# Altium project Flashlight PCB.PrjPCB
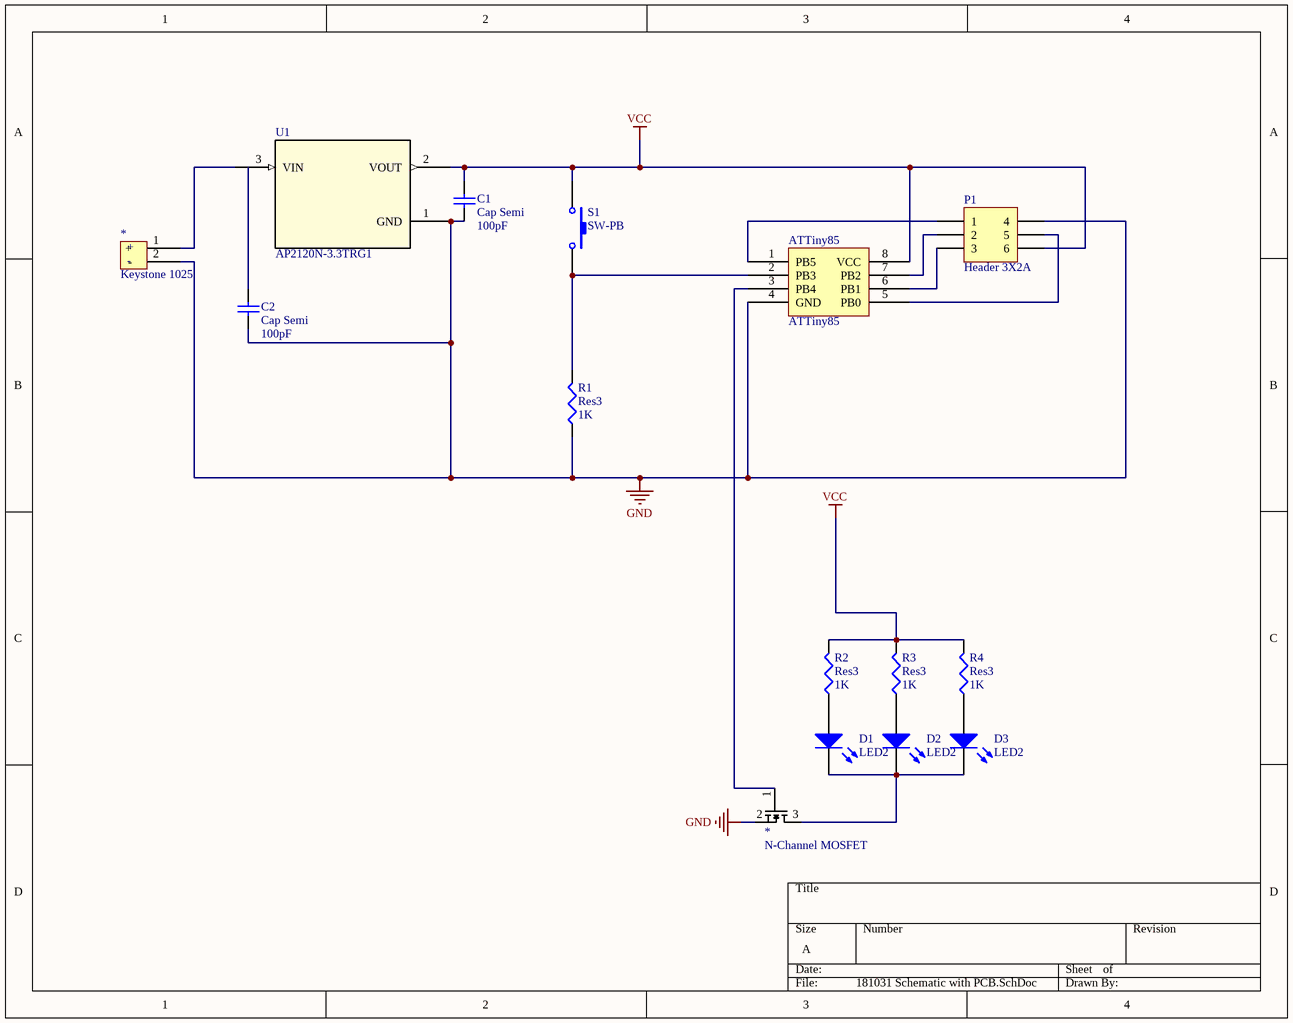
[diagram p0: 181031 Schematic with PCB.SchDoc]
1 sheet, 15 parts. Net scope: global (net labels, ports and power ports of the same name join across sheets).
Board file: Final Flashlight PCB.PcbDoc

## Sheet 181031 Schematic with PCB.SchDoc
size A

### Parts
(Parts that share a designator on the sheet are numbered #1, #2 ... from top to bottom, then left to right.)
*#1  Keystone 1025  [1025]
*#2  N-Channel MOSFET  [SOT416]
ATTiny85  ATTiny85  [8S2]
C1  Cap Semi  value 100pF  [1608[0603]]
C2  Cap Semi  value 100pF  [1608[0603]]
D1  LED2  [HDR1X2]
D2  LED2  [HDR1X2]
D3  LED2  [HDR1X2]
P1  Header 3X2A  [HDR2X3_CEN]
R1  Res3  value 1K  [J1-0603]
R2  Res3  value 1K  [J1-0603]
R3  Res3  value 1K  [J1-0603]
R4  Res3  value 1K  [J1-0603]
S1  SW-PB  [SPST-2]
U1  AP2120N-3.3TRG1  [SOT-23]

### Nets
GND: *#1.2(-) *#2.2(S) ATTiny85.4(GND) C1.1 C2.1 P1.4 R1.1 U1.1(GND)
VCC: ATTiny85.8(VCC) C1.2 P1.6 R2.2 R3.2 R4.2 S1.1 U1.2(VOUT)
Net*#1_1: *#1.1(+) U1.3(VIN)
Net*#2_1: *#2.1(G) ATTiny85.3(PB4)
Net*#2_3: *#2.3(D) D1.1(A) D2.1(A) D3.1(A)
NetATTiny85_1: ATTiny85.1(PB5) P1.1
NetATTiny85_2: ATTiny85.2(PB3) R1.2 S1.2
NetATTiny85_5: ATTiny85.5(PB0) P1.5
NetATTiny85_6: ATTiny85.6(PB1) P1.3
NetATTiny85_7: ATTiny85.7(PB2) P1.2
NetD1_2: D1.2(K) R2.1
NetD2_2: D2.2(K) R3.1
NetD3_2: D3.2(K) R4.1

Not connected (* = marked no-connect by the designer): C2 2

### Library data of the parts
*#1 = Keystone 1025: BATT HOLDER COIN 1/2 CELL PC PIN
ATTiny85 = ATTiny85_1
C1 C2 = Cap Semi: Capacitor (Semiconductor SIM Model); Published: 8-Jun-2000; LatestRevisionDate: 29-May-2009; LatestRevisionNote: IPC-7351 Footprint Added.; PackageReference: C1206; Publisher: Altium Limited; PackageDescription: Chip Capacitor
D1-D3 = LED2: Typical RED, GREEN, YELLOW, AMBER GaAs LED; Published: 8-Jun-2000; LatestRevisionDate: 17-Jul-2002; LatestRevisionNote: Re-released for DXP Platform.; PackageVersion: Feb-2002; PackageReference: 3.2X1.6X1.1; Publisher: Altium Limited; PackageDescription: SM LED; 2 Flat Leads
P1 = Header 3X2A: Header, 3-Pin, Dual row; LatestRevisionDate: 17-Jul-2002; LatestRevisionNote: Re-released for DXP Platform.; Publisher: Altium Limited
R1-R4 = Res3: Resistor; Published: 8-Jun-2000; LatestRevisionDate: 29-May-2009; LatestRevisionNote: IPC-7351 Footprint Added.; PackageReference: J1-0603; Publisher: Altium Limited; PackageDescription: Chip Resistor
S1 = SW-PB: Switch; Published: 24-Mar-1999; LatestRevisionDate: 17-Jul-2002; LatestRevisionNote: Re-released for DXP Platform.; PackageReference: SPST-2; Publisher: Altium Limited; PackageDescription: Switch; 2 Leads
U1 = AP2120N-3.3TRG1: IC REG LINEAR 3.3V 150MA SOT23; Vendor: Diodes Inc; Built_By: EMA_UL_Team; Manufacturer_Part_Number: AP2120N-3.3TRG1; RefDes: RefDes; Type: DEV; Value: Value